# Altium project AGUNO v1.0.PrjPcb
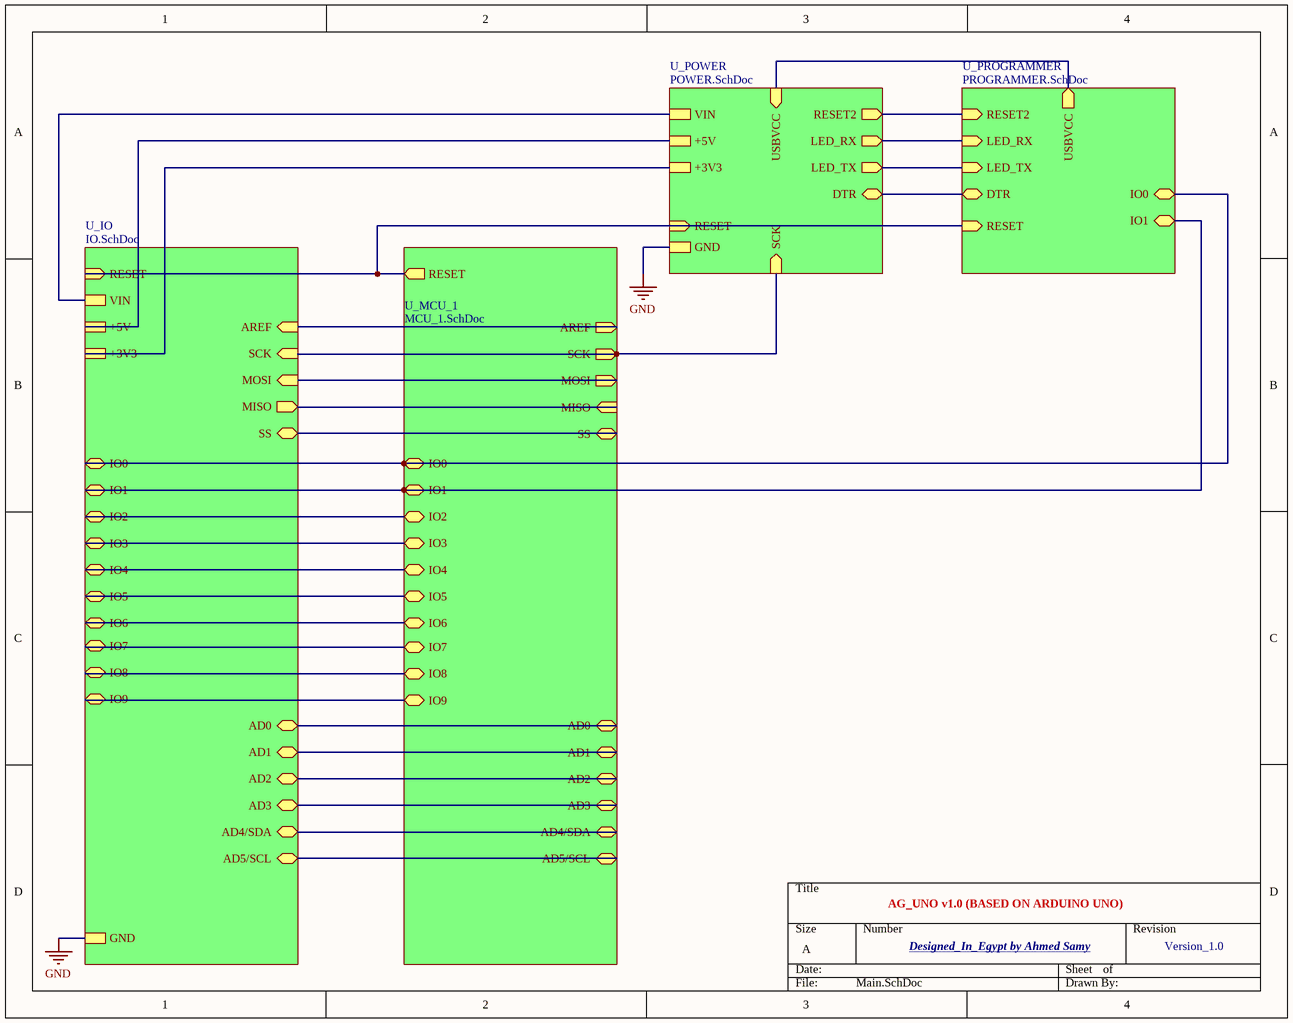
[diagram p0: Main.SchDoc]
5 sheets, 48 parts. Net scope: hierarchical (ports join the sheet entries above them; power ports are global).
Board file: AGUNO v1.0.PcbDoc
Sheets:
  Main.SchDoc
    U_POWER = POWER.SchDoc
    U_MCU_1 = MCU_1.SchDoc
    U_IO = IO.SchDoc
    U_PROGRAMMER = PROGRAMMER.SchDoc

## Sheet Main.SchDoc
size A; SheetNumber: 1; SheetTotal: 5

### Sub-sheets
U_IO = IO.SchDoc: AD5/SCL (bidir), AD4/SDA (bidir), AREF (in), SCK (in), MISO (out), MOSI (in), SS (bidir), IO9 (bidir), IO8 (bidir), IO7 (bidir), IO6 (bidir), IO5 (bidir), IO4 (bidir), IO3 (bidir), IO2 (bidir), IO1 (bidir), IO0 (bidir), GND, +5V, +3V3, VIN, RESET (in), AD0 (bidir), AD2 (bidir), AD1 (bidir), AD3 (bidir)
U_MCU_1 = MCU_1.SchDoc: AREF (out), IO9 (bidir), IO8 (bidir), IO7 (bidir), IO6 (bidir), IO5 (bidir), IO4 (bidir), IO3 (bidir), IO2 (bidir), SCK (out), MISO (in), MOSI (out), SS (bidir), AD5/SCL (bidir), AD4/SDA (bidir), RESET (out), IO1 (bidir), IO0 (bidir), AD0 (bidir), AD2 (bidir), AD1 (bidir), AD3 (bidir)
U_POWER = POWER.SchDoc: VIN, USBVCC (in), LED_RX (out), LED_TX (out), DTR (bidir), RESET2 (out), GND, +5V, +3V3, SCK (in), RESET (in)
U_PROGRAMMER = PROGRAMMER.SchDoc: USBVCC (out), LED_RX (in), LED_TX (in), DTR (bidir), RESET2 (in), IO1 (bidir), IO0 (bidir), RESET (in)

### Nets
+3V3: sheet U_POWER/+3V3, sheet U_IO/+3V3
+5: sheet U_POWER/+5V, sheet U_IO/+5V
GND: sheet U_POWER/GND, sheet U_IO/GND
AD0: sheet U_MCU_1/AD0, sheet U_IO/AD0
AD1: sheet U_MCU_1/AD1, sheet U_IO/AD1
AD2: sheet U_MCU_1/AD2, sheet U_IO/AD2
AD3: sheet U_MCU_1/AD3, sheet U_IO/AD3
AD4/SDA: sheet U_MCU_1/AD4/SDA, sheet U_IO/AD4/SDA
AD5/SCL: sheet U_MCU_1/AD5/SCL, sheet U_IO/AD5/SCL
AREF: sheet U_MCU_1/AREF, sheet U_IO/AREF
DTR: sheet U_POWER/DTR, sheet U_PROGRAMMER/DTR
IO0: sheet U_MCU_1/IO0, sheet U_IO/IO0, sheet U_PROGRAMMER/IO0
IO1: sheet U_MCU_1/IO1, sheet U_IO/IO1, sheet U_PROGRAMMER/IO1
IO2: sheet U_MCU_1/IO2, sheet U_IO/IO2
IO3: sheet U_MCU_1/IO3, sheet U_IO/IO3
IO4: sheet U_MCU_1/IO4, sheet U_IO/IO4
IO5: sheet U_MCU_1/IO5, sheet U_IO/IO5
IO6: sheet U_MCU_1/IO6, sheet U_IO/IO6
IO7: sheet U_MCU_1/IO7, sheet U_IO/IO7
IO8: sheet U_MCU_1/IO8, sheet U_IO/IO8
IO9: sheet U_MCU_1/IO9, sheet U_IO/IO9
LED_RX: sheet U_POWER/LED_RX, sheet U_PROGRAMMER/LED_RX
LED_TX: sheet U_POWER/LED_TX, sheet U_PROGRAMMER/LED_TX
MISO: sheet U_MCU_1/MISO, sheet U_IO/MISO
MOSI: sheet U_MCU_1/MOSI, sheet U_IO/MOSI
RESET: sheet U_POWER/RESET, sheet U_MCU_1/RESET, sheet U_IO/RESET, sheet U_PROGRAMMER/RESET
RESET2: sheet U_POWER/RESET2, sheet U_PROGRAMMER/RESET2
SCK: sheet U_POWER/SCK, sheet U_MCU_1/SCK, sheet U_IO/SCK
SS: sheet U_MCU_1/SS, sheet U_IO/SS
USBVCC: sheet U_POWER/USBVCC, sheet U_PROGRAMMER/USBVCC
VIN: sheet U_POWER/VIN, sheet U_IO/VIN

### Notes on the sheet
- AG_UNO v1.0 (BASED ON ARDUINO UNO)
- Designed_In_Egypt by Ahmed Samy
- Version_1.0

## Sheet POWER.SchDoc
size A; SheetNumber: 2; SheetTotal: 5
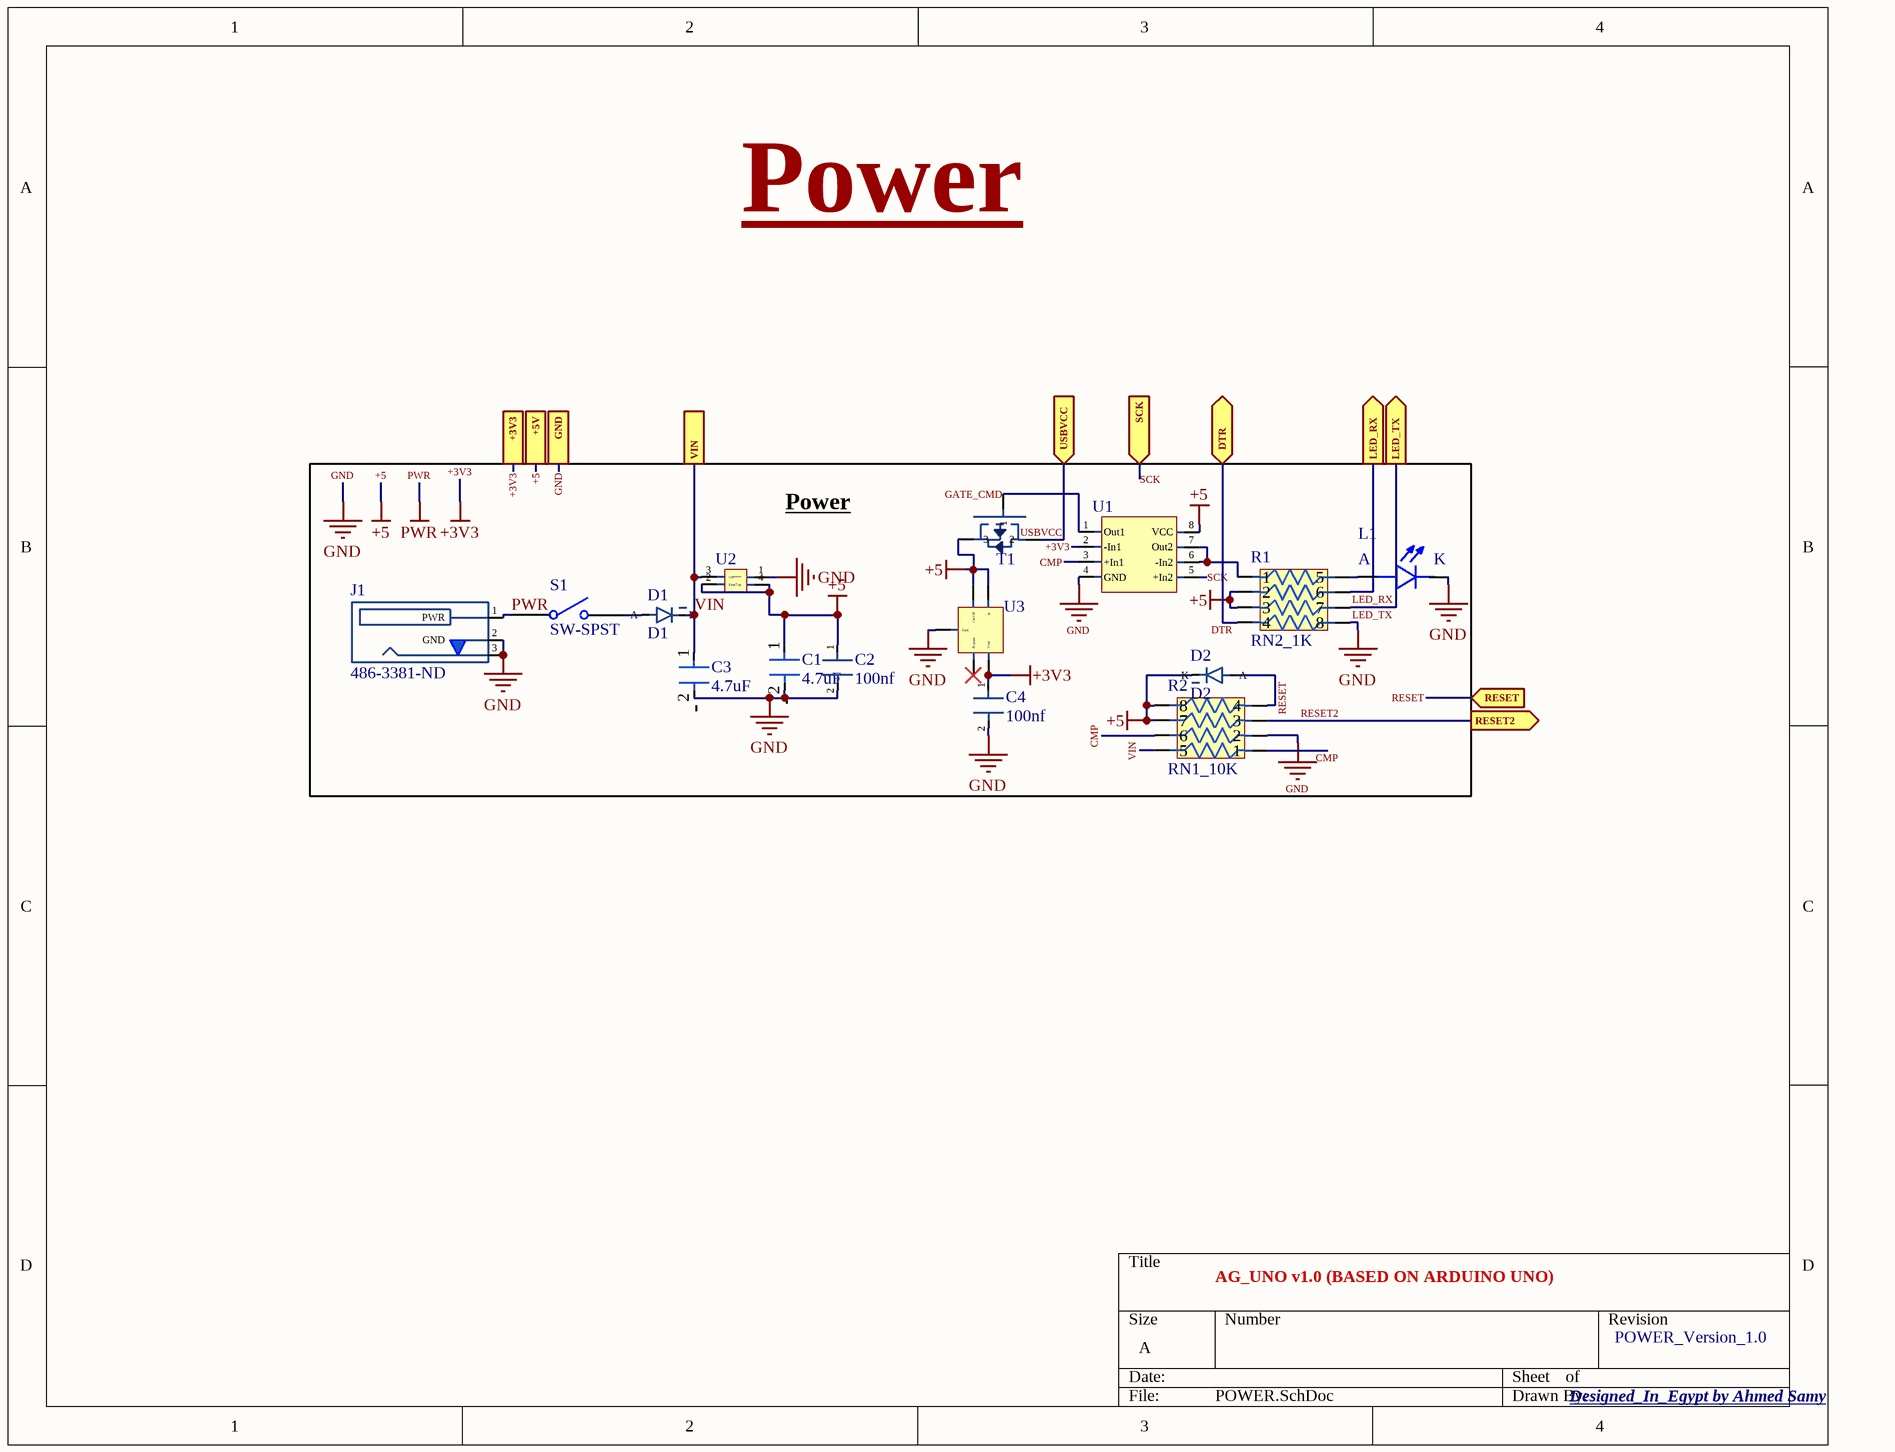
[diagram p1: POWER.SchDoc]

### Parts
C1  4.7uF  [P16437CT-ND]
C2  100nf  [CC0603KRX7R7BB105]
C3  4.7uF  [P16437CT-ND]
C4  100nf  [CC0603KRX7R7BB105]
D1  D1  [CGRA4007-G]
D2  D2  [CD1206-S01575]
J1  486-3381-ND  [486-3381-ND]
L1  LED_OPAMP  [LED_Q62702P5179]  (value not drawn)
R1  RN2_1K  [CAY16-103J4GLF]
R2  RN1_10K  [CAY16-103J4GLF]
S1  SW-SPST  [SPST-2]
T1  IRLML6402TRPBF  [IRLML6402TRPBF]  (value not drawn)
U1  LMV358LIST  [LMV358LIST]  (value not drawn)
U2  SPX1117M3-L-5-0/TR  [SPX1117M3-L-5-0/TR]  (value not drawn)
U3  LP2985-33DBVR  [LP2985-33DBVR]  (value not drawn)

### Ports
+3V3, +5V, DTR (bidir), GND, LED_RX (out), LED_TX (out), RESET2 (out), RESET (in), SCK (in), USBVCC (in), VIN

### Nets
+3V3: C4.1 U1.2(-In1) U3.5(Vout) ; port +3V3
+5: C1.1 C2.1 D2.1(K) R1.2 R1.3 R2.7 R2.8 T1.3 U1.8(VCC) U2.2(Vout) U2.4(Tap) U3.1(In) U3.3(On/Off) ; port +5V
GND: C1.2(-) C2.2 C3.2(-) C4.2 J1.2(GND) J1.3 L1.C R1.8 R2.2 U1.4(GND) U2.1(GND/ADJ) U3.2(Gnd) ; port GND
PWR: J1.1(PWR) S1.1(COMMON)
CMP: R2.1 R2.6 U1.3(+In1)
DTR: R1.4 ; port DTR
GATE_CMD: T1.1 U1.1(Out1)
LED_RX: R1.6 ; port LED_RX
LED_TX: R1.7 ; port LED_TX
RESET: D2.2(A) R2.4 ; port RESET
RESET2: R2.3 ; port RESET2
SCK: U1.5(+In2) ; port SCK
USBVCC: T1.2 ; port USBVCC
VIN: C3.1 D1.1(K) R2.5 U2.3(Vin) ; port VIN
NetD1_2: D1.2(A) S1.2(NO)
NetL1_A: L1.A R1.5
NetR1_1: R1.1 U1.6(-In2) U1.7(Out2)

Not connected (* = marked no-connect by the designer): U3 4(Bypass)*

### Notes on the sheet
- Power
- AG_UNO v1.0 (BASED ON ARDUINO UNO)
- POWER_Version_1.0
- Designed_In_Egypt by Ahmed Samy
- (in symbol LED_Q62702P5179) K

### Library data of the parts
C1 C3 = P16437CT-ND: CAP ALUM POLY 4.7UF 20% 10V SMD
C2 C4 = CC0603KRX7R7BB105: 1 µF ±10% 16V Ceramic Capacitor X7R 0603 (1608 Metric)
D1 = CGRA4007-G: Diode 1000 V 1A Surface Mount DO-214AC (SMA) [used in UNO]
D2 = CD1206-S01575: Diode 100 V 150mA Surface Mount 1206 [D2 UNO]
J1 = 486-3381-ND: Power Barrel Connector Jack 2.10mm ID (0.083"), 5.50mm OD (0.217") Through Hole, Right Angle
L1 = LED_Q62702P5179: LED 0805
R1 R2 = CAY16-103J4GLF: 10k Ohm ±5% 62.5mW Power Per Element Isolated 4 Resistor Network/Array ±200ppm/°C 1206 (3216 Metric), Convex, Long Side Terminals
S1 = SW-SPST: Single-Pole, Single-Throw Switch; Published: 24-Mar-1999; LatestRevisionDate: 17-Jul-2002; LatestRevisionNote: Re-released for DXP Platform.; PackageReference: SPST-2; Publisher: Altium Limited; PackageDescription: Switch; 2 Leads
T1 = IRLML6402TRPBF: P-Channel 20 V 3.7A (Ta) 1.3W (Ta) Surface Mount Micro3™/SOT-23
U1 = LMV358LIST: General Purpose Amplifier 2 Circuit Rail-to-Rail 8-MiniSO
U2 = SPX1117M3-L-5-0/TR: Linear Voltage Regulator IC Positive Fixed 1 Output 800mA SOT-223-3
U3 = LP2985-33DBVR: Linear Voltage Regulator IC Positive Fixed 1 Output 150mA SOT-23-5

## Sheet MCU_1.SchDoc
size A; SheetNumber: 4; SheetTotal: 5
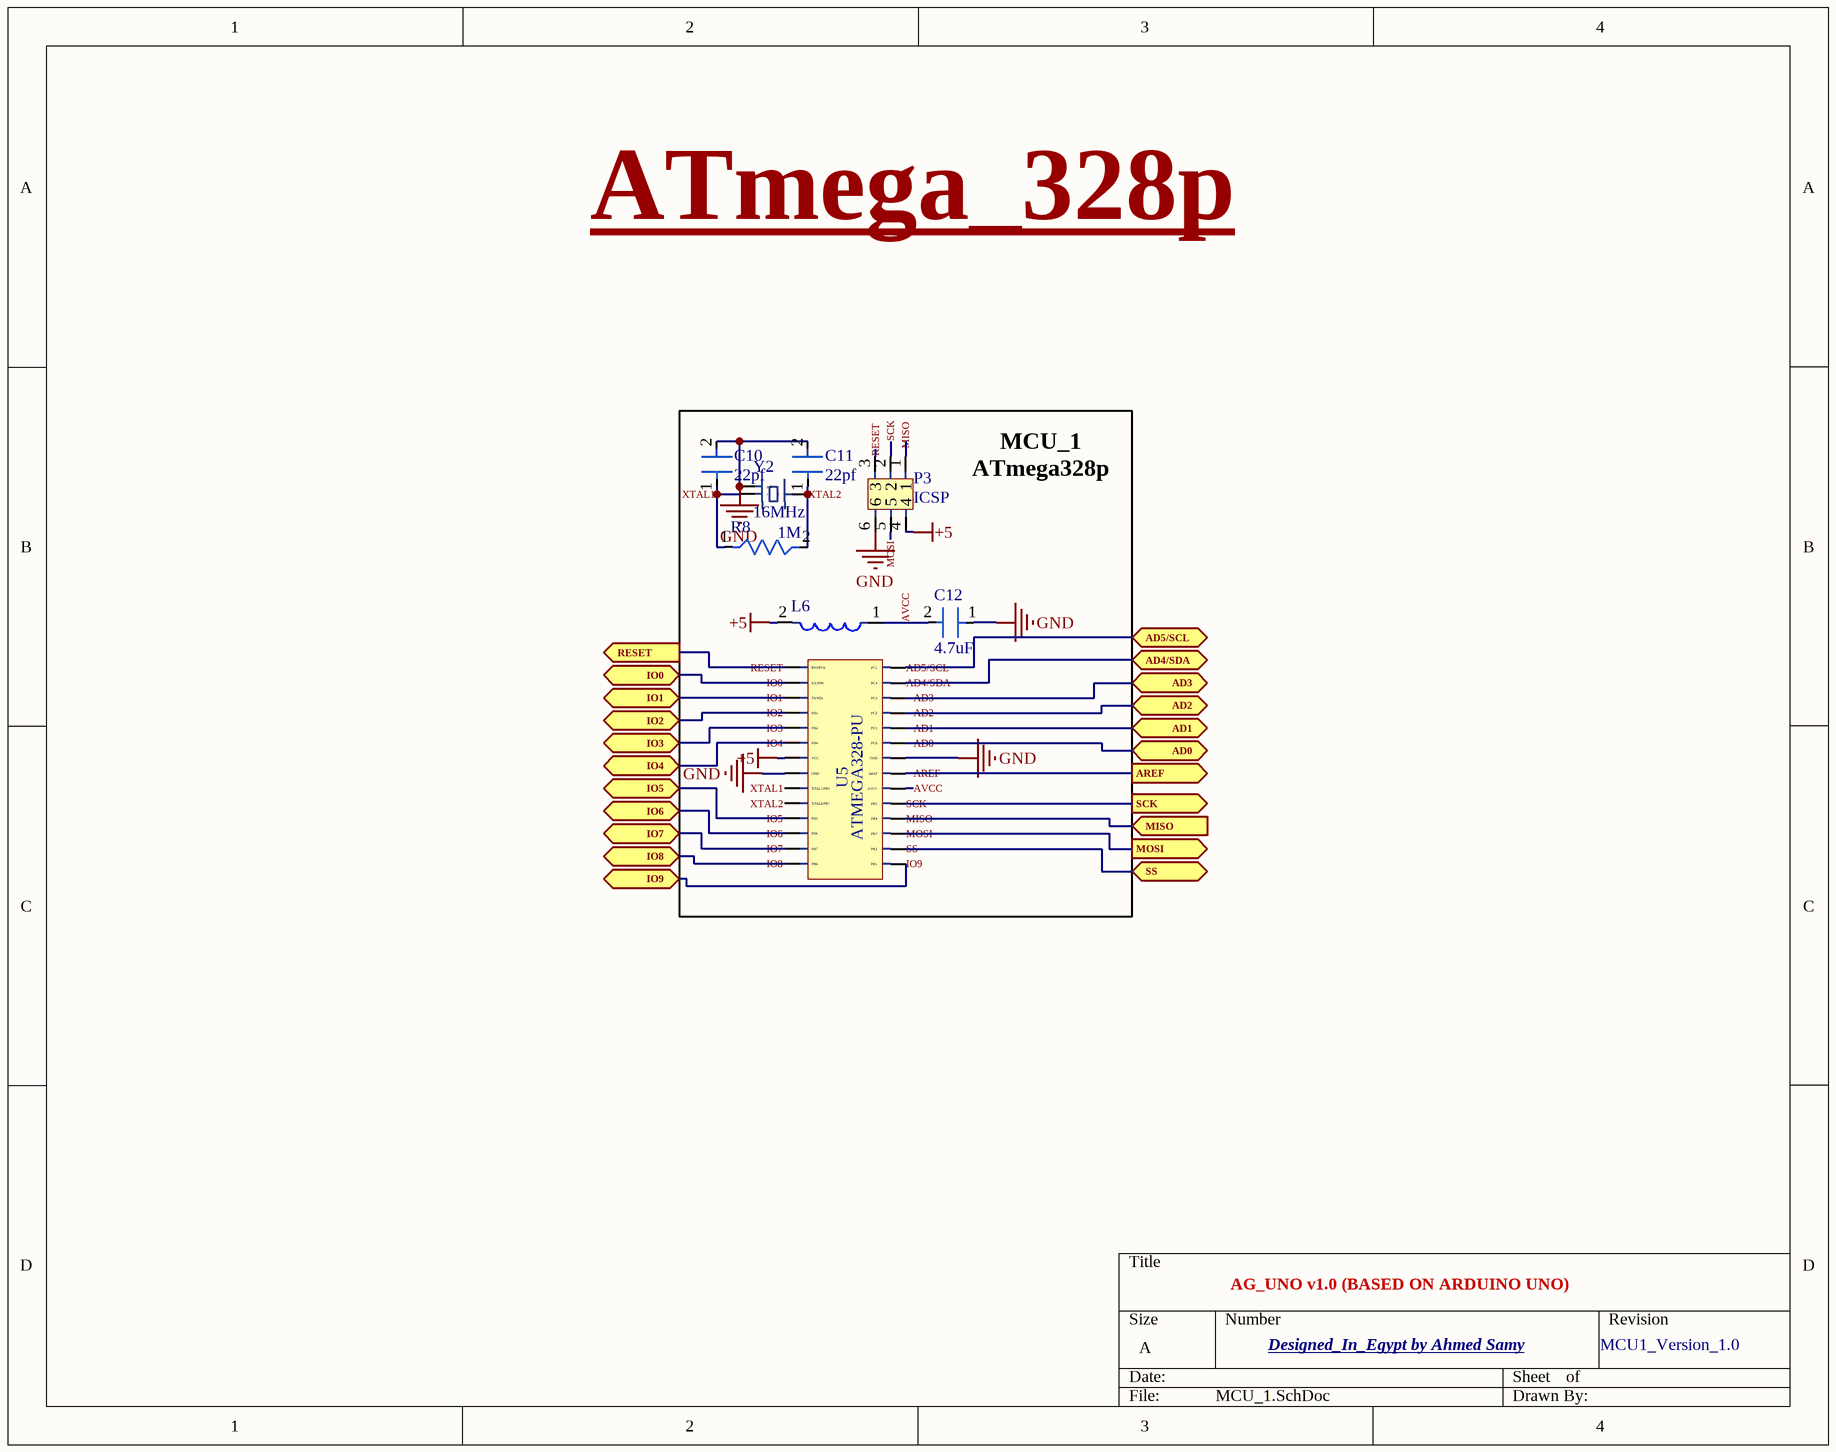
[diagram p2: MCU_1.SchDoc]

### Parts
C10  22pf  [3372-0805W475K500CCTR-ND]
C11  22pf  [3372-0805W475K500CCTR-ND]
C12  4.7uF  [3372-0805W475K500CCTR-ND]
L6  CV201210-100K  [CV201210-100K]  (value not drawn)
P3  ICSP  [PH2-06-UA]
R8  1M  [CRCW06031M00JNEAC]
U5  ATMEGA328-PU  [ATMEGA328-PU]
Y2  16MHz  [CSTCE16M0V53-R0]

### Ports
AD0 (bidir), AD1 (bidir), AD2 (bidir), AD3 (bidir), AD4/SDA (bidir), AD5/SCL (bidir), AREF (out), IO0 (bidir), IO1 (bidir), IO2 (bidir), IO3 (bidir), IO4 (bidir), IO5 (bidir), IO6 (bidir), IO7 (bidir), IO8 (bidir), IO9 (bidir), MISO (in), MOSI (out), RESET (out), SCK (out), SS (bidir)

### Nets
+5: L6.2 P3.4 U5.7(VCC)
GND: C10.2 C11.2 C12.1 P3.6 U5.8(GND) U5.22(GND) Y2.2(gnd)
AD0: U5.23(PC0) ; port AD0
AD1: U5.24(PC1) ; port AD1
AD2: U5.25(PC2) ; port AD2
AD3: U5.26(PC3) ; port AD3
AD4/SDA: U5.27(PC4) ; port AD4/SDA
AD5/SCL: U5.28(PC5) ; port AD5/SCL
AREF: U5.21(AREF) ; port AREF
AVCC: C12.2 L6.1 U5.20(AVCC)
IO0: U5.2(RX/PD0) ; port IO0
IO1: U5.3(TX/PD1) ; port IO1
IO2: U5.4(PD2) ; port IO2
IO3: U5.5(PD3) ; port IO3
IO4: U5.6(PD4) ; port IO4
IO5: U5.11(PD5) ; port IO5
IO6: U5.12(PD6) ; port IO6
IO7: U5.13(PD7) ; port IO7
IO8: U5.14(PB0) ; port IO8
IO9: U5.15(PB1) ; port IO9
MISO: P3.1 U5.18(PB4) ; port MISO
MOSI: P3.5 U5.17(PB3) ; port MOSI
RESET: P3.3 U5.1(RST/PC6) ; port RESET
SCK: P3.2 U5.19(PB5) ; port SCK
SS: U5.16(PB2) ; port SS
XTAL1: C10.1 R8.1 U5.9(XTAL1/PB6) Y2.1
XTAL2: C11.1 R8.2 U5.10(XTAL2/PB7) Y2.3

### Notes on the sheet
- ATmega_328p
- (near P3) MCU_1
  ATmega328p
- AG_UNO v1.0 (BASED ON ARDUINO UNO)
- Designed_In_Egypt by Ahmed Samy
- MCU1_Version_1.0

### Library data of the parts
C10-C12 = 3372-0805W475K500CCTR-ND: CAP.,SMD,0805,X5R,4.7UF,10%,50V
L6 = CV201210-100K: 10 µH Shielded Multilayer Inductor 15 mA 1.15Ohm Max 0805 (2012 Metric)
P3 = PH2-06-UA: Connector Header Through Hole 6 position 0.100" (2.54mm) [ICSP UNO]
R8 = CRCW06031M00JNEAC: 1 MOhms ±5% 0.1W, 1/10W Chip Resistor 0603 (1608 Metric) Thick Film
U5 = ATMEGA328-PU: AVR AVR® ATmega Microcontroller IC 8-Bit 20MHz 32KB (16K x 16) FLASH 28-PDIP
Y2 = CSTCE16M0V53-R0: 16 MHz Ceramic Resonator Built in Capacitor 15 pF ±0.3% -20°C ~ 80°C Surface Mount

## Sheet IO.SchDoc
size A; SheetNumber: 5; SheetTotal: 5
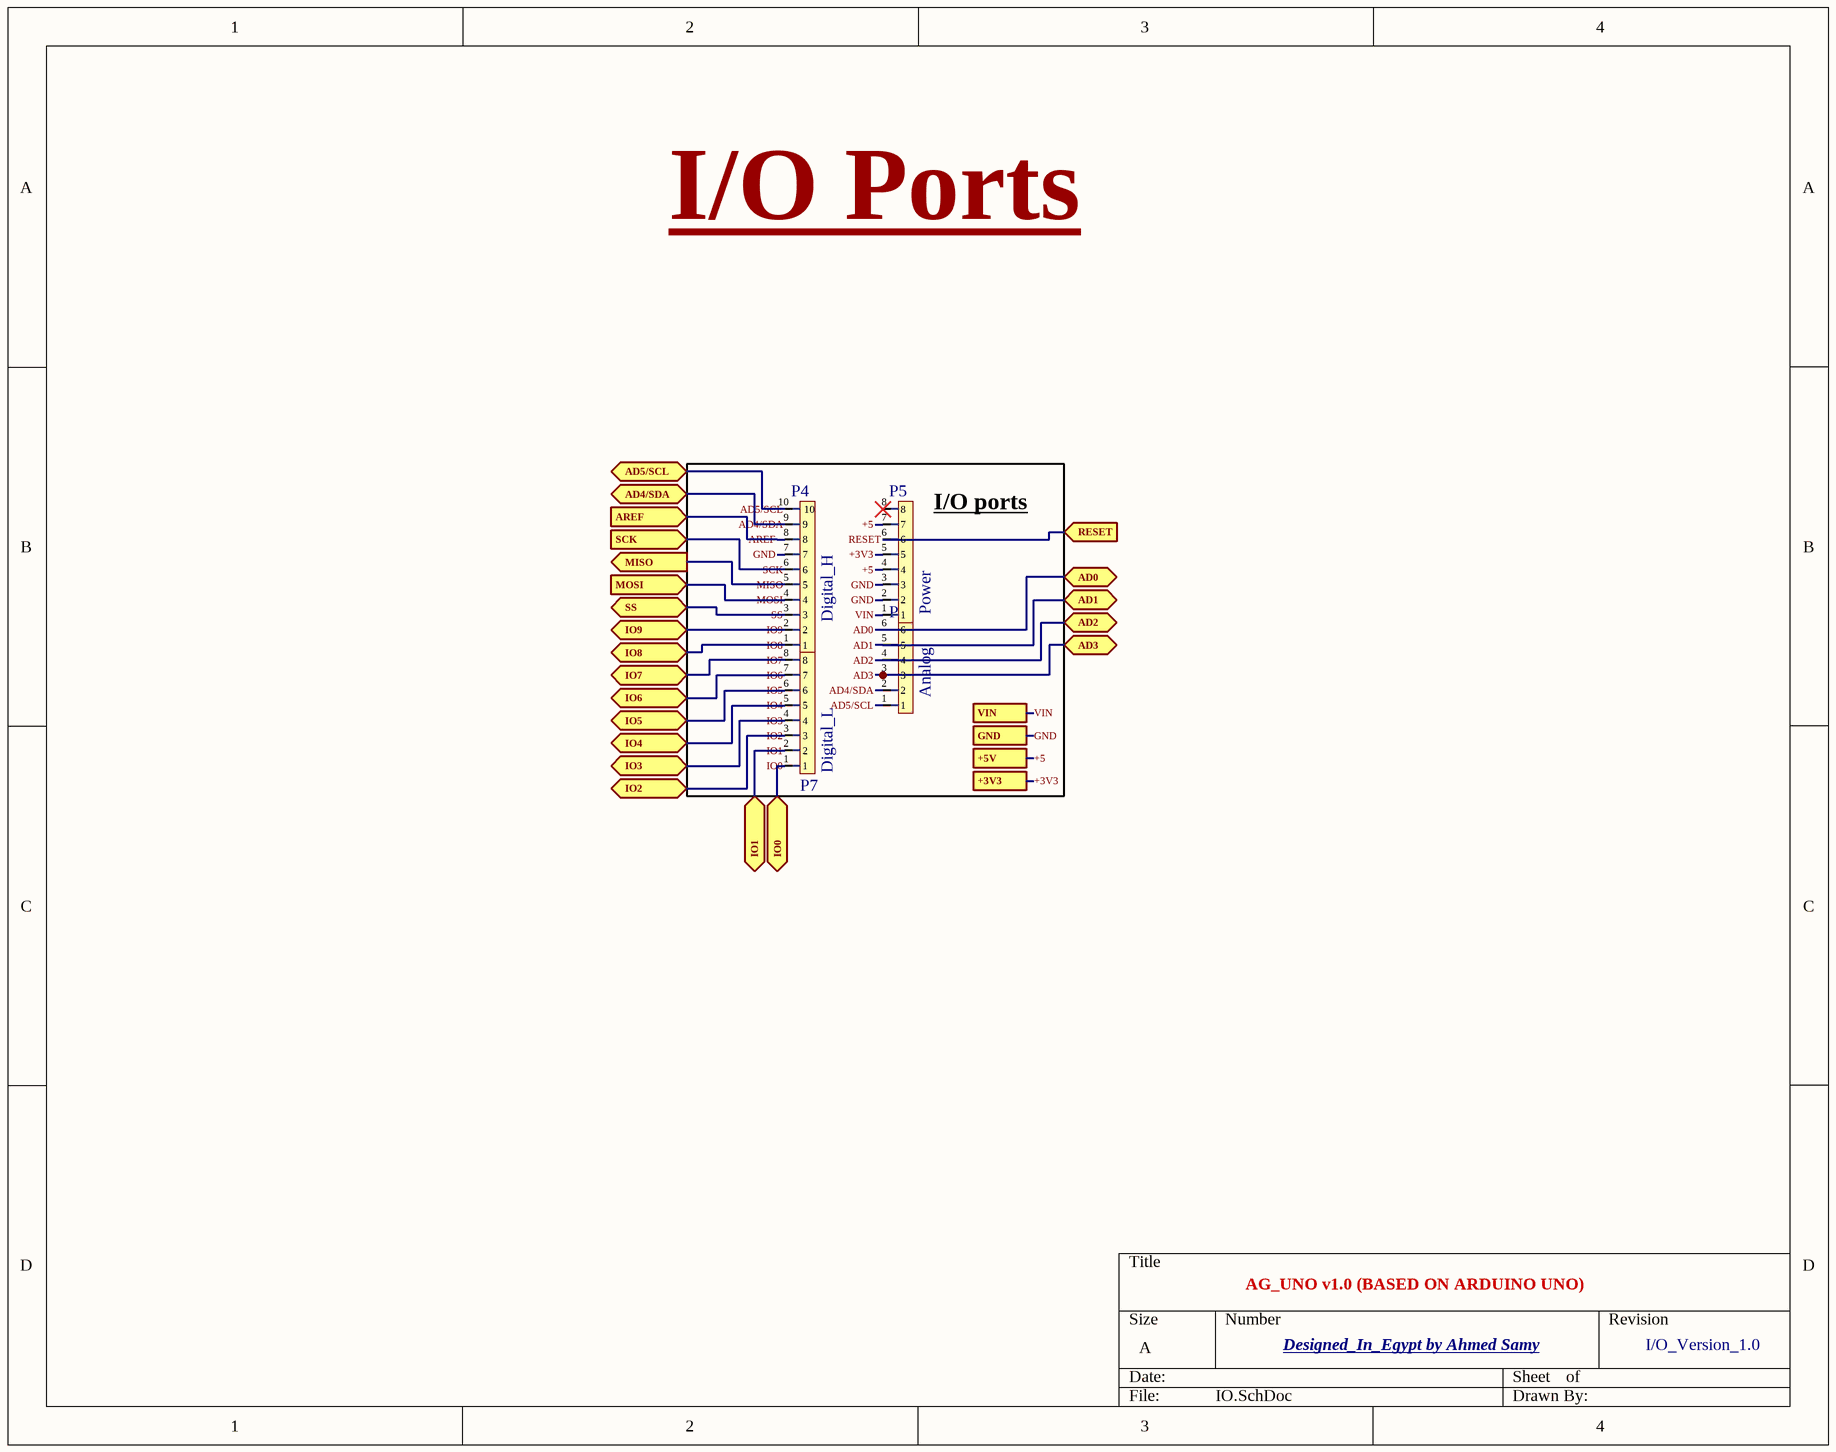
[diagram p3: IO.SchDoc]

### Parts
P4  Digital_H  [NPPN101BFCN-RC]
P5  Power  [PPTC081LFBN-RC]
P6  Analog  [PPTC061LFBN-RC]
P7  Digital_L  [PPTC081LFBN-RC]

### Ports
+3V3, +5V, AD0 (bidir), AD1 (bidir), AD2 (bidir), AD3 (bidir), AD4/SDA (bidir), AD5/SCL (bidir), AREF (in), GND, IO0 (bidir), IO1 (bidir), IO2 (bidir), IO3 (bidir), IO4 (bidir), IO5 (bidir), IO6 (bidir), IO7 (bidir), IO8 (bidir), IO9 (bidir), MISO (out), MOSI (in), RESET (in), SCK (in), SS (bidir), VIN

### Nets
+3V3: P5.5 ; port +3V3
+5: P5.4 P5.7 ; port +5V
GND: P4.7 P5.2 P5.3 ; port GND
AD0: P6.6 ; port AD0
AD1: P6.5 ; port AD1
AD2: P6.4 ; port AD2
AD3: P6.3 ; port AD3
AD4/SDA: P4.9 P6.2 ; port AD4/SDA
AD5/SCL: P4.10 P6.1 ; port AD5/SCL
AREF: P4.8 ; port AREF
IO0: P7.1 ; port IO0
IO1: P7.2 ; port IO1
IO2: P7.3 ; port IO2
IO3: P7.4 ; port IO3
IO4: P7.5 ; port IO4
IO5: P7.6 ; port IO5
IO6: P7.7 ; port IO6
IO7: P7.8 ; port IO7
IO8: P4.1 ; port IO8
IO9: P4.2 ; port IO9
MISO: P4.5 ; port MISO
MOSI: P4.4 ; port MOSI
RESET: P5.6 ; port RESET
SCK: P4.6 ; port SCK
SS: P4.3 ; port SS
VIN: P5.1 ; port VIN

Not connected (* = marked no-connect by the designer): P5 8*

### Notes on the sheet
- I/O Ports
- (near P5) I/O ports
- AG_UNO v1.0 (BASED ON ARDUINO UNO)
- Designed_In_Egypt by Ahmed Samy
- I/O_Version_1.0

### Library data of the parts
P4 = NPPN101BFCN-RC: 10 Position Header Connector 0.079" (2.00mm) Through Hole Gold
P5 P7 = PPTC081LFBN-RC: 8 Position Header Connector 0.100" (2.54mm) Through Hole Tin
P6 = PPTC061LFBN-RC: 6 Position Female Pin Header Connector 0.100" (2.54mm) Through Hole Tin

## Sheet PROGRAMMER.SchDoc
size A; SheetNumber: 3; SheetTotal: 5
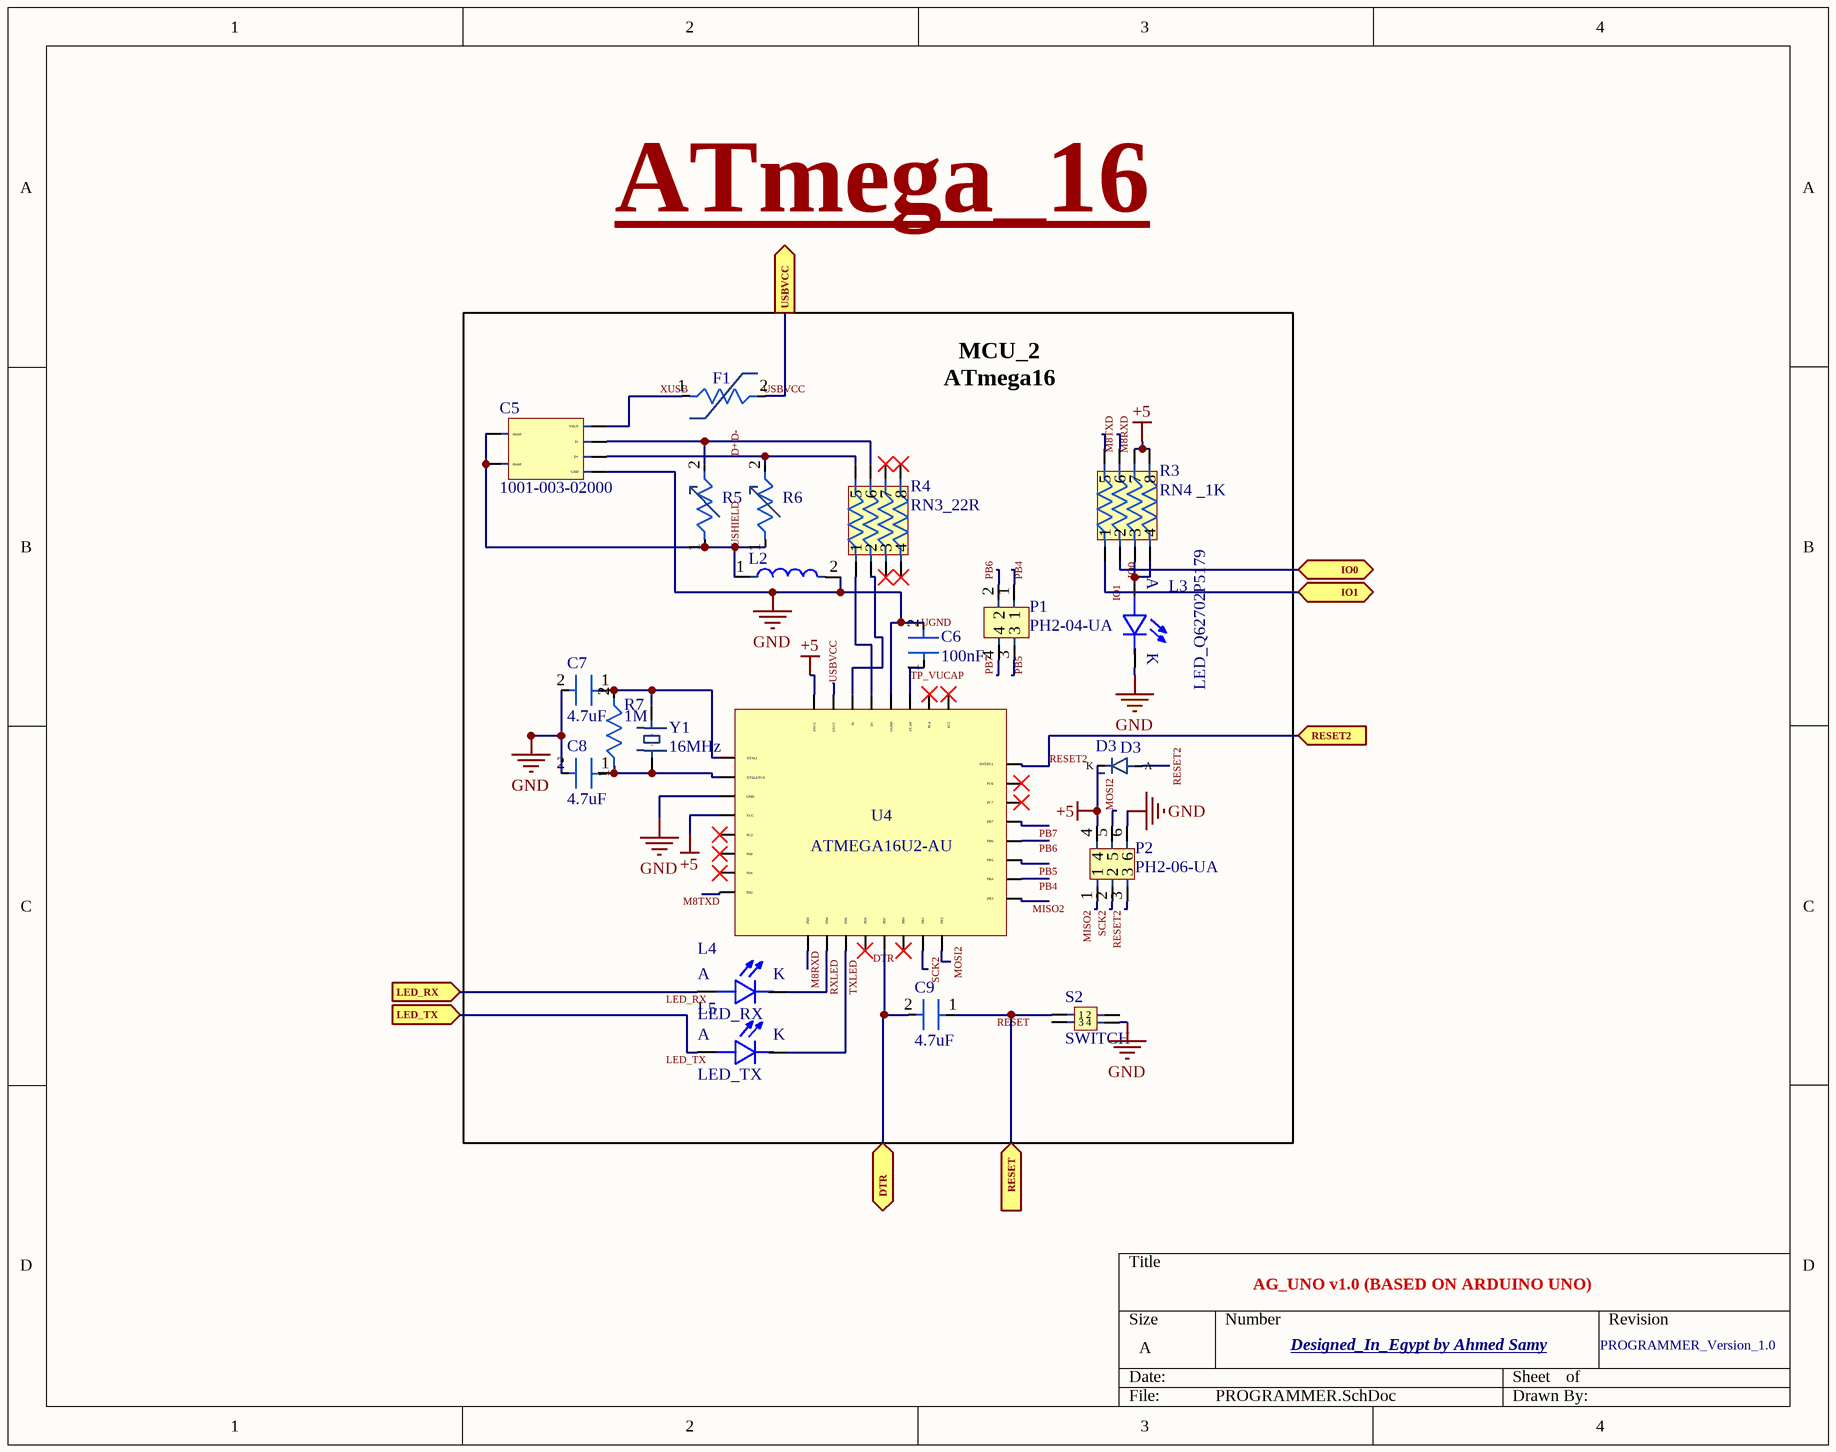
[diagram p4: PROGRAMMER.SchDoc]

### Parts
C5  1001-003-02000  [1001-003-02000]
C6  100nF  [80-C0805C104M3R]
C7  4.7uF  [3372-0805W475K500CCTR-ND]
C8  4.7uF  [3372-0805W475K500CCTR-ND]
C9  4.7uF  [3372-0805W475K500CCTR-ND]
D3  D3  [CD1206-S01575]
F1  MF-MSMF050-2  [MF-MSMF050-2]  (value not drawn)
L2  BLM21PG300SN1D  [BLM21PG300SN1D]  (value not drawn)
L3  LED_Q62702P5179  [LED_Q62702P5179]
L4  LED_RX  [LED_Q62702P5179]
L5  LED_TX  [LED_Q62702P5179]
P1  PH2-04-UA  [PH2-04-UA]
P2  PH2-06-UA  [PH2-06-UA]
R3  RN4 _1K  [CAY16-103J4GLF]
R4  RN3_22R  [CAY16-103J4GLF]
R5  CG0603MLC-05E  [CG0603MLC-05E]  (value not drawn)
R6  CG0603MLC-05E  [CG0603MLC-05E]  (value not drawn)
R7  1M  [CRCW06031M00JNEAC]
S2  SWITCH  [B3SL-1002P]
U4  ATMEGA16U2-AU  [ATMEGA16U2-AU]
Y1  16MHz  [ECS-160-20-4X-DU]

### Ports
DTR (bidir), IO0 (bidir), IO1 (bidir), LED_RX (in), LED_TX (in), RESET2 (in), RESET (in), USBVCC (out)

### Nets
+5: D3.1(K) P2.4 R3.7 R3.8 U4.4(VCC) U4.32(AVCC)
GND: C5.6(GND) C6.2 C7.2 C8.2 L2.2 L3.C P2.6 S2.4 U4.3(GND) U4.28(UGND)  [also labelled UGND]
D+: C5.5(D+) R4.5 R6.2
D-: C5.4(D-) R4.6 R5.2
DTR: C9.2 U4.13(PD7) ; port DTR
IO0: R3.2 ; port IO0
IO1: R3.1 ; port IO1
LED_RX: L4.A ; port LED_RX
LED_TX: L5.A ; port LED_TX
M8RXD: R3.6 U4.9(PD3)
M8TXD: R3.5 U4.8(PD2)
MISO2: P2.1 U4.17(PB3)
MOSI2: P2.5 U4.16(PB2)
PB4: P1.1 U4.18(PB4)
PB5: P1.3 U4.19(PB5)
PB6: P1.2 U4.20(PB6)
PB7: P1.4 U4.21(PB7)
RESET: C9.1 S2.1 ; port RESET
RESET2: D3.2(A) P2.3 U4.24(RST/PC1) ; port RESET2
RXLED: L4.C U4.10(PD4)
SCK2: P2.2 U4.15(PB1)
TP_VUCAP: C6.1 U4.27(UCAP)
TXLED: L5.C U4.11(PD5)
USBVCC: F1.2 U4.31(UVCC) ; port USBVCC
USHIELD: C5.1(shield) C5.2(shield) L2.1 R5.1 R6.1
XUSB: C5.3(VBUS) F1.1
NetC7_1: C7.1 R7.2 U4.1(XTAL1) Y1.1
NetC8_1: C8.1 R7.1 U4.2(XTAL2/PC0) Y1.2
NetL3_A: L3.A R3.3 R3.4
NetR4_1: R4.1 U4.29(D+)
NetR4_2: R4.2 U4.30(D-)

Not connected (* = marked no-connect by the designer): R4 3* 4* 7* 8*; S2 2 3; U4 5(PC2)* 6(PD0)* 7(PD1)* 12(PD6)* 14(PB0)* 22(PC7)* 23(PC6)* 25(PC5)* 26(PC4)*

### Notes on the sheet
- ATmega_16
- MCU_2
  ATmega16
- AG_UNO v1.0 (BASED ON ARDUINO UNO)
- Designed_In_Egypt by Ahmed Samy
- PROGRAMMER_Version_1.0
- (in symbol LED_Q62702P5179) K

### Library data of the parts
C5 = 1001-003-02000: USB-B (USB TYPE-B) USB 1.1 Receptacle Connector 4 Position Through Hole, Right Angle
C6 = 80-C0805C104M3R: Multilayer Ceramic Capacitors MLCC - SMD/SMT NEW GLOBAL PN KAM21BR71H104KM 50V 0.1uF X7R 0805 10% AEC-Q200
C7-C9 = 3372-0805W475K500CCTR-ND: CAP.,SMD,0805,X5R,4.7UF,10%,50V
D3 = CD1206-S01575: as D2 on sheet POWER
F1 = MF-MSMF050-2: Polymeric PTC Resettable Fuse 15V 500 mA Ih Surface Mount 1812 (4532 Metric), Concave [UNO]
L2 = BLM21PG300SN1D: 30 Ohms @ 100 MHz 1 Power Line Ferrite Bead 0805 (2012 Metric) 4A 14mOhm
L3-L5 = LED_Q62702P5179: LED 0805
P1 = PH2-04-UA: Connector Header Through Hole 4 position 0.100" (2.54mm)
P2 = PH2-06-UA: as P3 on sheet MCU_1
R3 R4 = CAY16-103J4GLF: as R1 on sheet POWER
R5 R6 = CG0603MLC-05E: Varistor 1 Circuit Surface Mount, MLCV 0603 (1608 Metric)
R7 = CRCW06031M00JNEAC: as R8 on sheet MCU_1
S2 = B3SL-1002P: Tactile Switch SPST-NO Top Actuated Surface Mount
U4 = ATMEGA16U2-AU: AVR AVR® ATmega Microcontroller IC 8-Bit 16MHz 16KB (8K x 16) FLASH 32-TQFP (7x7)
Y1 = ECS-160-20-4X-DU: 16 MHz ±30ppm Crystal 20pF 40 Ohms HC-49/US

## Nets that join several sheets
+3V3: POWER (C4.1 U1.2 U3.5), IO (P5.5)
+5: POWER (13 pins), MCU_1 (L6.2 P3.4 U5.7), IO (P5.4 P5.7), PROGRAMMER (6 pins)
GND: POWER (12 pins), MCU_1 (7 pins), IO (P4.7 P5.2 P5.3), PROGRAMMER (10 pins)
AD0: MCU_1 (U5.23), IO (P6.6)
AD1: MCU_1 (U5.24), IO (P6.5)
AD2: MCU_1 (U5.25), IO (P6.4)
AD3: MCU_1 (U5.26), IO (P6.3)
AD4/SDA: MCU_1 (U5.27), IO (P4.9 P6.2)
AD5/SCL: MCU_1 (U5.28), IO (P4.10 P6.1)
AREF: MCU_1 (U5.21), IO (P4.8)
DTR: POWER (R1.4), PROGRAMMER (C9.2 U4.13)
IO0: MCU_1 (U5.2), IO (P7.1), PROGRAMMER (R3.2)
IO1: MCU_1 (U5.3), IO (P7.2), PROGRAMMER (R3.1)
IO2: MCU_1 (U5.4), IO (P7.3)
IO3: MCU_1 (U5.5), IO (P7.4)
IO4: MCU_1 (U5.6), IO (P7.5)
IO5: MCU_1 (U5.11), IO (P7.6)
IO6: MCU_1 (U5.12), IO (P7.7)
IO7: MCU_1 (U5.13), IO (P7.8)
IO8: MCU_1 (U5.14), IO (P4.1)
IO9: MCU_1 (U5.15), IO (P4.2)
LED_RX: POWER (R1.6), PROGRAMMER (L4.A)
LED_TX: POWER (R1.7), PROGRAMMER (L5.A)
MISO: MCU_1 (P3.1 U5.18), IO (P4.5)
MOSI: MCU_1 (P3.5 U5.17), IO (P4.4)
RESET: POWER (D2.2 R2.4), MCU_1 (P3.3 U5.1), IO (P5.6), PROGRAMMER (C9.1 S2.1)
RESET2: POWER (R2.3), PROGRAMMER (D3.2 P2.3 U4.24)
SCK: POWER (U1.5), MCU_1 (P3.2 U5.19), IO (P4.6)
SS: MCU_1 (U5.16), IO (P4.3)
USBVCC: POWER (T1.2), PROGRAMMER (F1.2 U4.31)
VIN: POWER (C3.1 D1.1 R2.5 U2.3), IO (P5.1)